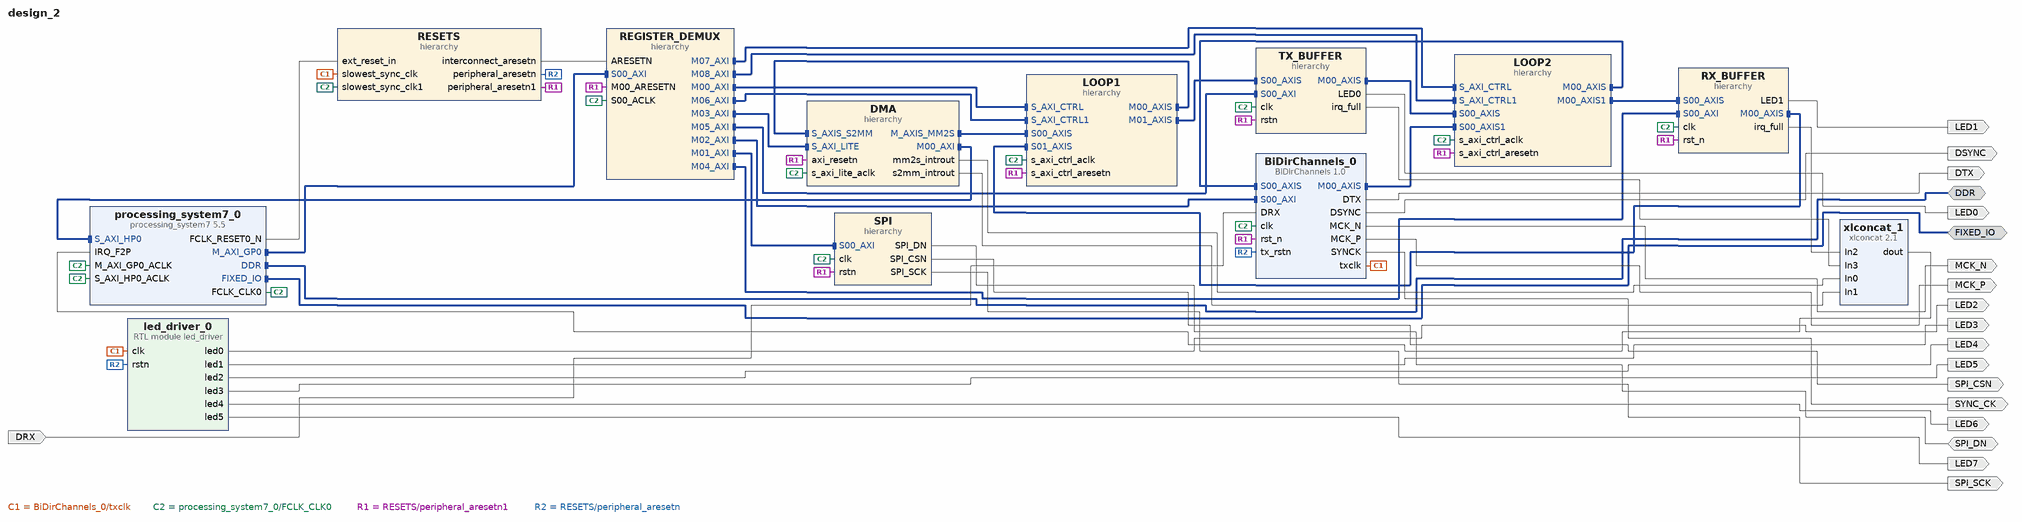
[diagram p0: block diagram of the top level]
# Vivado block design design_2, xc7z020clg484-1, Vivado 2021.2
create_bd_design design_2

create_bd_intf_port -mode Master -vlnv xilinx.com:interface:ddrx_rtl:1.0 DDR
create_bd_intf_port -mode Master -vlnv xilinx.com:display_processing_system7:fixedio_rtl:1.0 FIXED_IO
create_bd_port -dir O -type data SPI_SCK
create_bd_port -dir O -type data SPI_CSN
create_bd_port -dir I -type data DRX
create_bd_port -dir O -type data DSYNC
create_bd_port -dir O -type data DTX
create_bd_port -dir O -type clk SYNC_CK
create_bd_port -dir O -type clk MCK_N
create_bd_port -dir O -type clk MCK_P
create_bd_port -dir O LED0
create_bd_port -dir O LED1
create_bd_port -dir O LED2
create_bd_port -dir O LED3
create_bd_port -dir O LED4
create_bd_port -dir O LED5
create_bd_port -dir O LED6
create_bd_port -dir O LED7
create_bd_port -dir IO SPI_DN

create_bd_cell -type ip -vlnv xilinx.com:ip:processing_system7:5.5 processing_system7_0
set_property -dict [list \
  CONFIG.PCW_APU_PERIPHERAL_FREQMHZ 666.666667 \
  CONFIG.PCW_ENET0_ENET0_IO {MIO 16 .. 27} \
  CONFIG.PCW_ENET0_GRP_MDIO_ENABLE 1 \
  CONFIG.PCW_ENET0_GRP_MDIO_IO {MIO 52 .. 53} \
  CONFIG.PCW_ENET0_PERIPHERAL_ENABLE 1 \
  CONFIG.PCW_ENET0_RESET_ENABLE 0 \
  CONFIG.PCW_ENET_RESET_ENABLE 1 \
  CONFIG.PCW_ENET_RESET_SELECT {Share reset pin} \
  CONFIG.PCW_FPGA0_PERIPHERAL_FREQMHZ 100.000000 \
  CONFIG.PCW_FPGA1_PERIPHERAL_FREQMHZ 150.000000 \
  CONFIG.PCW_GPIO_MIO_GPIO_ENABLE 1 \
  CONFIG.PCW_GPIO_MIO_GPIO_IO MIO \
  CONFIG.PCW_I2C_RESET_ENABLE 1 \
  CONFIG.PCW_IRQ_F2P_INTR 1 \
  CONFIG.PCW_PERIPHERAL_BOARD_PRESET part0 \
  CONFIG.PCW_PRESET_BANK1_VOLTAGE {LVCMOS 1.8V} \
  CONFIG.PCW_QSPI_GRP_SINGLE_SS_ENABLE 1 \
  CONFIG.PCW_QSPI_GRP_SINGLE_SS_IO {MIO 1 .. 6} \
  CONFIG.PCW_QSPI_PERIPHERAL_ENABLE 1 \
  CONFIG.PCW_QSPI_QSPI_IO {MIO 1 .. 6} \
  CONFIG.PCW_SD0_GRP_CD_ENABLE 1 \
  CONFIG.PCW_SD0_GRP_CD_IO {MIO 47} \
  CONFIG.PCW_SD0_GRP_WP_ENABLE 1 \
  CONFIG.PCW_SD0_GRP_WP_IO {MIO 46} \
  CONFIG.PCW_SD0_PERIPHERAL_ENABLE 1 \
  CONFIG.PCW_SD0_SD0_IO {MIO 40 .. 45} \
  CONFIG.PCW_SDIO_PERIPHERAL_FREQMHZ 50 \
  CONFIG.PCW_SINGLE_QSPI_DATA_MODE x4 \
  CONFIG.PCW_TTC0_PERIPHERAL_ENABLE 1 \
  CONFIG.PCW_TTC0_TTC0_IO EMIO \
  CONFIG.PCW_UART1_PERIPHERAL_ENABLE 1 \
  CONFIG.PCW_UART1_UART1_IO {MIO 48 .. 49} \
  CONFIG.PCW_UART_PERIPHERAL_FREQMHZ 50 \
  CONFIG.PCW_UIPARAM_DDR_FREQ_MHZ 533.333313 \
  CONFIG.PCW_UIPARAM_DDR_PARTNO {MT41J128M16 HA-15E} \
  CONFIG.PCW_USB0_PERIPHERAL_ENABLE 1 \
  CONFIG.PCW_USB0_RESET_ENABLE 0 \
  CONFIG.PCW_USB0_USB0_IO {MIO 28 .. 39} \
  CONFIG.PCW_USB_RESET_ENABLE 1 \
  CONFIG.PCW_USB_RESET_SELECT {Share reset pin} \
  CONFIG.PCW_USE_FABRIC_INTERRUPT 1 \
  CONFIG.PCW_USE_S_AXI_HP0 1 \
  CONFIG.preset ZedBoard \
] [get_bd_cells processing_system7_0]
# 516 more settings of processing_system7_0 are not shown: defaults, MIO pin electricals, DDR timing, and values the tool derives
create_bd_cell -type hier RX_BUFFER
create_bd_cell -type hier LOOP1
create_bd_cell -type hier LOOP2
create_bd_cell -type hier RESETS
create_bd_cell -type hier SPI
create_bd_cell -type hier DMA
create_bd_cell -type hier REGISTER_DEMUX
create_bd_cell -type hier TX_BUFFER
create_bd_cell -type module -reference led_driver led_driver_0
create_bd_cell -type ip -vlnv xilinx.com:user:BiDirChannels:1.0 BiDirChannels_0
create_bd_cell -type ip -vlnv xilinx.com:ip:xlconcat:2.1 xlconcat_1
set_property -dict {CONFIG.NUM_PORTS 4} [get_bd_cells xlconcat_1]

# ---- hierarchy /RX_BUFFER ----
current_bd_instance /RX_BUFFER
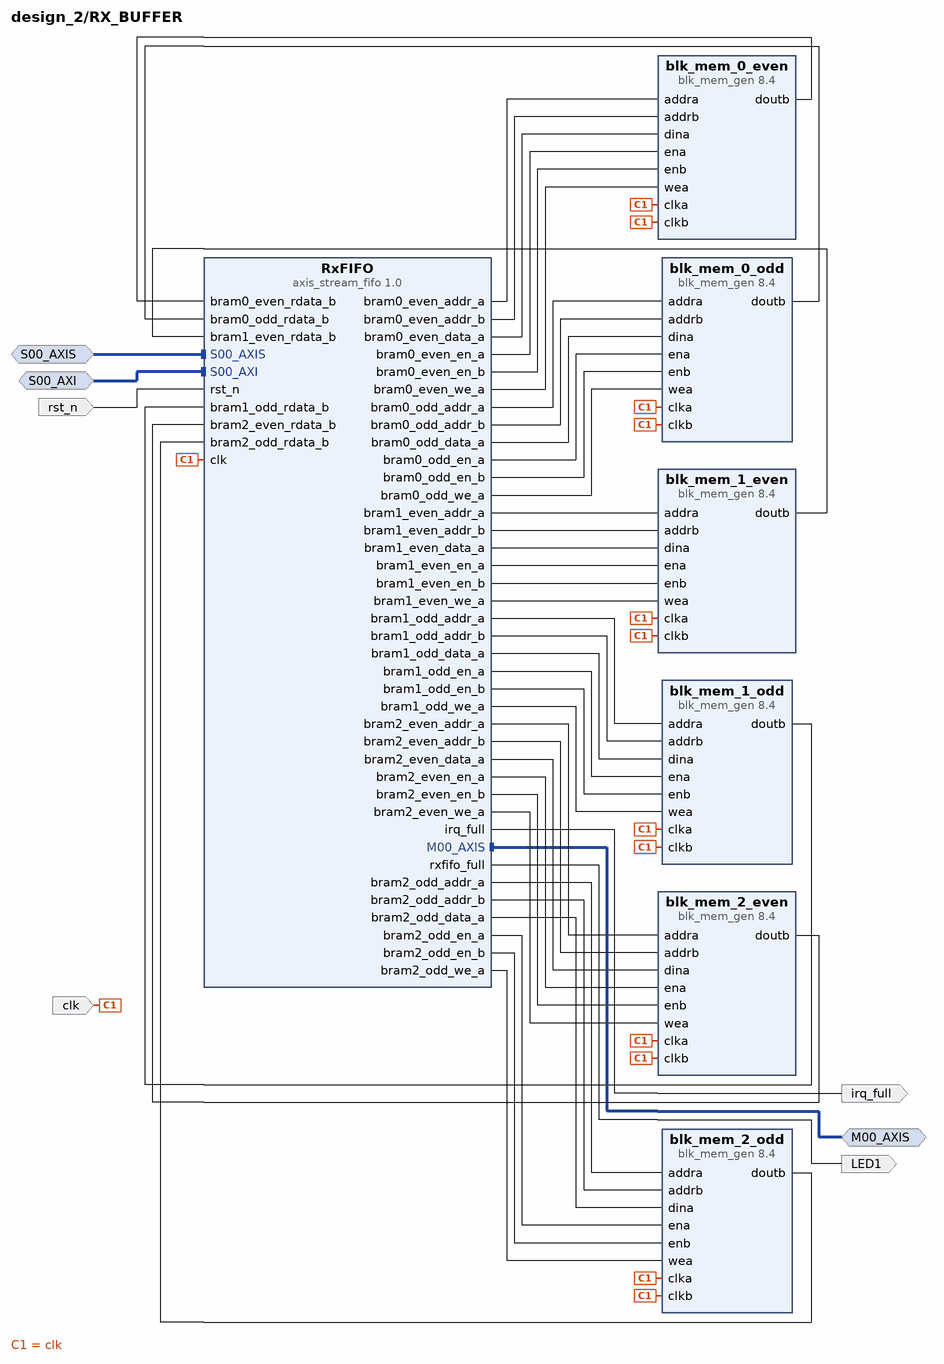
[diagram p1: block diagram inside /RX_BUFFER]
create_bd_intf_pin -mode Slave -vlnv xilinx.com:interface:aximm_rtl:1.0 S00_AXI
create_bd_intf_pin -mode Slave -vlnv xilinx.com:interface:axis_rtl:1.0 S00_AXIS
create_bd_intf_pin -mode Master -vlnv xilinx.com:interface:axis_rtl:1.0 M00_AXIS
create_bd_pin -dir I -type clk clk
create_bd_pin -dir I -type rst rst_n
create_bd_pin -dir O LED1
create_bd_pin -dir O irq_full

create_bd_cell -type ip -vlnv xilinx.com:ip:blk_mem_gen:8.4 blk_mem_1_even
set_property -dict [list \
  CONFIG.Assume_Synchronous_Clk true \
  CONFIG.Enable_32bit_Address false \
  CONFIG.Enable_B Use_ENB_Pin \
  CONFIG.Memory_Type Simple_Dual_Port_RAM \
  CONFIG.Operating_Mode_A NO_CHANGE \
  CONFIG.Port_A_Write_Rate 50 \
  CONFIG.Port_B_Clock 100 \
  CONFIG.Port_B_Enable_Rate 100 \
  CONFIG.Read_Width_B 16 \
  CONFIG.Register_PortB_Output_of_Memory_Primitives true \
  CONFIG.Use_Byte_Write_Enable false \
  CONFIG.Use_RSTB_Pin false \
  CONFIG.Write_Width_A 16 \
  CONFIG.Write_Width_B 16 \
  CONFIG.use_bram_block Stand_Alone \
] [get_bd_cells blk_mem_1_even]
create_bd_cell -type ip -vlnv xilinx.com:ip:blk_mem_gen:8.4 blk_mem_2_odd
set_property -dict [list \
  CONFIG.Assume_Synchronous_Clk true \
  CONFIG.Enable_32bit_Address false \
  CONFIG.Enable_B Use_ENB_Pin \
  CONFIG.Memory_Type Simple_Dual_Port_RAM \
  CONFIG.Operating_Mode_A NO_CHANGE \
  CONFIG.Port_A_Write_Rate 50 \
  CONFIG.Port_B_Clock 100 \
  CONFIG.Port_B_Enable_Rate 100 \
  CONFIG.Read_Width_B 16 \
  CONFIG.Register_PortB_Output_of_Memory_Primitives true \
  CONFIG.Use_Byte_Write_Enable false \
  CONFIG.Use_RSTB_Pin false \
  CONFIG.Write_Width_A 16 \
  CONFIG.Write_Width_B 16 \
  CONFIG.use_bram_block Stand_Alone \
] [get_bd_cells blk_mem_2_odd]
create_bd_cell -type ip -vlnv xilinx.com:ip:blk_mem_gen:8.4 blk_mem_2_even
set_property -dict [list \
  CONFIG.Assume_Synchronous_Clk true \
  CONFIG.Enable_32bit_Address false \
  CONFIG.Enable_B Use_ENB_Pin \
  CONFIG.Memory_Type Simple_Dual_Port_RAM \
  CONFIG.Operating_Mode_A NO_CHANGE \
  CONFIG.Port_A_Write_Rate 50 \
  CONFIG.Port_B_Clock 100 \
  CONFIG.Port_B_Enable_Rate 100 \
  CONFIG.Read_Width_B 16 \
  CONFIG.Register_PortB_Output_of_Memory_Primitives true \
  CONFIG.Use_Byte_Write_Enable false \
  CONFIG.Use_RSTB_Pin false \
  CONFIG.Write_Width_A 16 \
  CONFIG.Write_Width_B 16 \
  CONFIG.use_bram_block Stand_Alone \
] [get_bd_cells blk_mem_2_even]
create_bd_cell -type ip -vlnv xilinx.com:ip:blk_mem_gen:8.4 blk_mem_0_even
set_property -dict [list \
  CONFIG.Assume_Synchronous_Clk true \
  CONFIG.Enable_32bit_Address false \
  CONFIG.Enable_B Use_ENB_Pin \
  CONFIG.Memory_Type Simple_Dual_Port_RAM \
  CONFIG.Operating_Mode_A NO_CHANGE \
  CONFIG.Port_A_Write_Rate 50 \
  CONFIG.Port_B_Clock 100 \
  CONFIG.Port_B_Enable_Rate 100 \
  CONFIG.Read_Width_B 16 \
  CONFIG.Register_PortB_Output_of_Memory_Primitives true \
  CONFIG.Use_Byte_Write_Enable false \
  CONFIG.Use_RSTB_Pin false \
  CONFIG.Write_Width_A 16 \
  CONFIG.Write_Width_B 16 \
  CONFIG.use_bram_block Stand_Alone \
] [get_bd_cells blk_mem_0_even]
create_bd_cell -type ip -vlnv xilinx.com:ip:blk_mem_gen:8.4 blk_mem_1_odd
set_property -dict [list \
  CONFIG.Assume_Synchronous_Clk true \
  CONFIG.Enable_32bit_Address false \
  CONFIG.Enable_B Use_ENB_Pin \
  CONFIG.Memory_Type Simple_Dual_Port_RAM \
  CONFIG.Operating_Mode_A NO_CHANGE \
  CONFIG.Port_A_Write_Rate 50 \
  CONFIG.Port_B_Clock 100 \
  CONFIG.Port_B_Enable_Rate 100 \
  CONFIG.Read_Width_B 16 \
  CONFIG.Register_PortB_Output_of_Memory_Primitives true \
  CONFIG.Use_Byte_Write_Enable false \
  CONFIG.Use_RSTB_Pin false \
  CONFIG.Write_Width_A 16 \
  CONFIG.Write_Width_B 16 \
  CONFIG.use_bram_block Stand_Alone \
] [get_bd_cells blk_mem_1_odd]
create_bd_cell -type ip -vlnv xilinx.com:ip:blk_mem_gen:8.4 blk_mem_0_odd
set_property -dict [list \
  CONFIG.Assume_Synchronous_Clk true \
  CONFIG.Enable_32bit_Address false \
  CONFIG.Enable_B Use_ENB_Pin \
  CONFIG.Memory_Type Simple_Dual_Port_RAM \
  CONFIG.Operating_Mode_A NO_CHANGE \
  CONFIG.Port_A_Write_Rate 50 \
  CONFIG.Port_B_Clock 100 \
  CONFIG.Port_B_Enable_Rate 100 \
  CONFIG.Read_Width_B 16 \
  CONFIG.Register_PortB_Output_of_Memory_Primitives true \
  CONFIG.Use_Byte_Write_Enable false \
  CONFIG.Use_RSTB_Pin false \
  CONFIG.Write_Width_A 16 \
  CONFIG.Write_Width_B 16 \
  CONFIG.use_bram_block Stand_Alone \
] [get_bd_cells blk_mem_0_odd]
create_bd_cell -type ip -vlnv xilinx.com:user:axis_stream_fifo:1.0 RxFIFO
set_property -dict {CONFIG.C_S00_AXIS_TDATA_WIDTH 48} [get_bd_cells RxFIFO]

# ---- hierarchy /LOOP1 ----
current_bd_instance /LOOP1
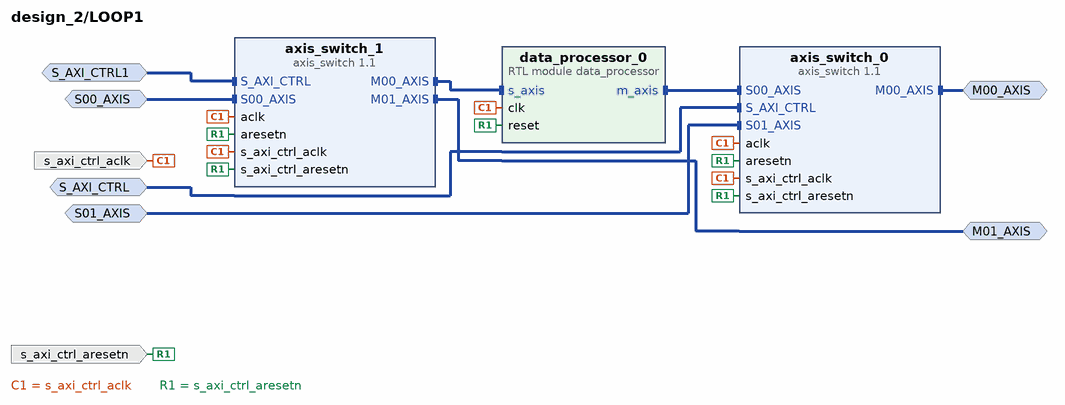
[diagram p2: block diagram inside /LOOP1]
create_bd_intf_pin -mode Master -vlnv xilinx.com:interface:axis_rtl:1.0 M00_AXIS
create_bd_intf_pin -mode Slave -vlnv xilinx.com:interface:axis_rtl:1.0 S01_AXIS
create_bd_intf_pin -mode Slave -vlnv xilinx.com:interface:aximm_rtl:1.0 S_AXI_CTRL
create_bd_intf_pin -mode Slave -vlnv xilinx.com:interface:axis_rtl:1.0 S00_AXIS
create_bd_intf_pin -mode Master -vlnv xilinx.com:interface:axis_rtl:1.0 M01_AXIS
create_bd_intf_pin -mode Slave -vlnv xilinx.com:interface:aximm_rtl:1.0 S_AXI_CTRL1
create_bd_pin -dir I -type clk s_axi_ctrl_aclk
create_bd_pin -dir I -type rst s_axi_ctrl_aresetn

create_bd_cell -type ip -vlnv xilinx.com:ip:axis_switch:1.1 axis_switch_0
set_property -dict {CONFIG.ROUTING_MODE 1} [get_bd_cells axis_switch_0]
create_bd_cell -type ip -vlnv xilinx.com:ip:axis_switch:1.1 axis_switch_1
set_property -dict {CONFIG.DECODER_REG 1 CONFIG.NUM_MI 2 CONFIG.NUM_SI 1 CONFIG.ROUTING_MODE 1} [get_bd_cells axis_switch_1]
create_bd_cell -type module -reference data_processor data_processor_0

# ---- hierarchy /LOOP2 ----
current_bd_instance /LOOP2
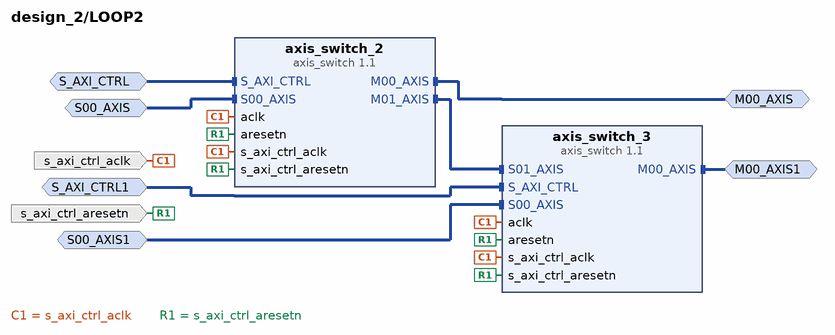
[diagram p3: block diagram inside /LOOP2]
create_bd_intf_pin -mode Slave -vlnv xilinx.com:interface:axis_rtl:1.0 S00_AXIS
create_bd_intf_pin -mode Master -vlnv xilinx.com:interface:axis_rtl:1.0 M00_AXIS
create_bd_intf_pin -mode Slave -vlnv xilinx.com:interface:aximm_rtl:1.0 S_AXI_CTRL
create_bd_intf_pin -mode Slave -vlnv xilinx.com:interface:axis_rtl:1.0 S00_AXIS1
create_bd_intf_pin -mode Master -vlnv xilinx.com:interface:axis_rtl:1.0 M00_AXIS1
create_bd_intf_pin -mode Slave -vlnv xilinx.com:interface:aximm_rtl:1.0 S_AXI_CTRL1
create_bd_pin -dir I -type clk s_axi_ctrl_aclk
create_bd_pin -dir I -type rst s_axi_ctrl_aresetn

create_bd_cell -type ip -vlnv xilinx.com:ip:axis_switch:1.1 axis_switch_2
set_property -dict {CONFIG.DECODER_REG 1 CONFIG.NUM_MI 2 CONFIG.NUM_SI 1 CONFIG.ROUTING_MODE 1} [get_bd_cells axis_switch_2]
create_bd_cell -type ip -vlnv xilinx.com:ip:axis_switch:1.1 axis_switch_3
set_property -dict {CONFIG.ROUTING_MODE 1} [get_bd_cells axis_switch_3]

# ---- hierarchy /RESETS ----
current_bd_instance /RESETS
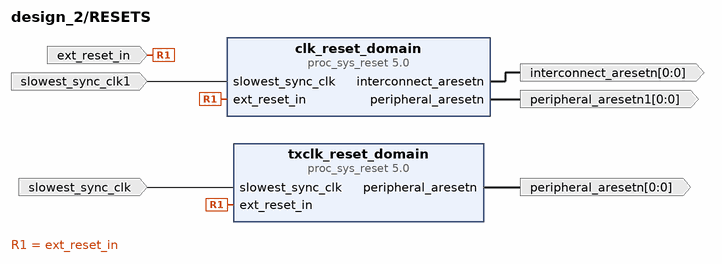
[diagram p4: block diagram inside /RESETS]
create_bd_pin -dir I -type clk slowest_sync_clk
create_bd_pin -dir I -type rst ext_reset_in
create_bd_pin -dir O -from 0 -to 0 -type rst peripheral_aresetn
create_bd_pin -dir I -type clk slowest_sync_clk1
create_bd_pin -dir O -from 0 -to 0 -type rst interconnect_aresetn
create_bd_pin -dir O -from 0 -to 0 -type rst peripheral_aresetn1

create_bd_cell -type ip -vlnv xilinx.com:ip:proc_sys_reset:5.0 txclk_reset_domain
create_bd_cell -type ip -vlnv xilinx.com:ip:proc_sys_reset:5.0 clk_reset_domain

# ---- hierarchy /SPI ----
current_bd_instance /SPI
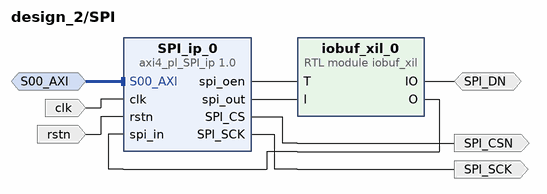
[diagram p5: block diagram inside /SPI]
create_bd_intf_pin -mode Slave -vlnv xilinx.com:interface:aximm_rtl:1.0 S00_AXI
create_bd_pin -dir I -type clk clk
create_bd_pin -dir I -type rst rstn
create_bd_pin -dir O SPI_SCK
create_bd_pin -dir O SPI_CSN
create_bd_pin -dir IO SPI_DN

create_bd_cell -type ip -vlnv xilinx.com:user:axi4_pl_SPI_ip:1.0 SPI_ip_0
create_bd_cell -type module -reference iobuf_xil iobuf_xil_0

# ---- hierarchy /DMA ----
current_bd_instance /DMA
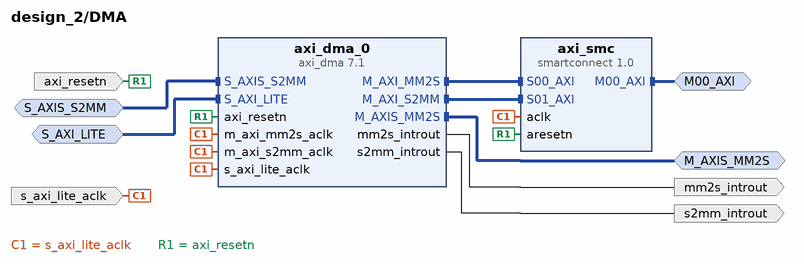
[diagram p6: block diagram inside /DMA]
create_bd_intf_pin -mode Master -vlnv xilinx.com:interface:aximm_rtl:1.0 M00_AXI
create_bd_intf_pin -mode Slave -vlnv xilinx.com:interface:aximm_rtl:1.0 S_AXI_LITE
create_bd_intf_pin -mode Master -vlnv xilinx.com:interface:axis_rtl:1.0 M_AXIS_MM2S
create_bd_intf_pin -mode Slave -vlnv xilinx.com:interface:axis_rtl:1.0 S_AXIS_S2MM
create_bd_pin -dir I -type clk s_axi_lite_aclk
create_bd_pin -dir I -type rst axi_resetn
create_bd_pin -dir O -type intr mm2s_introut
create_bd_pin -dir O -type intr s2mm_introut

create_bd_cell -type ip -vlnv xilinx.com:ip:smartconnect:1.0 axi_smc
set_property -dict {CONFIG.NUM_SI 2} [get_bd_cells axi_smc]
create_bd_cell -type ip -vlnv xilinx.com:ip:axi_dma:7.1 axi_dma_0
set_property -dict [list \
  CONFIG.c_include_sg 0 \
  CONFIG.c_mm2s_burst_size 256 \
  CONFIG.c_s2mm_burst_size 256 \
  CONFIG.c_sg_length_width 26 \
] [get_bd_cells axi_dma_0]

# ---- hierarchy /REGISTER_DEMUX ----
current_bd_instance /REGISTER_DEMUX
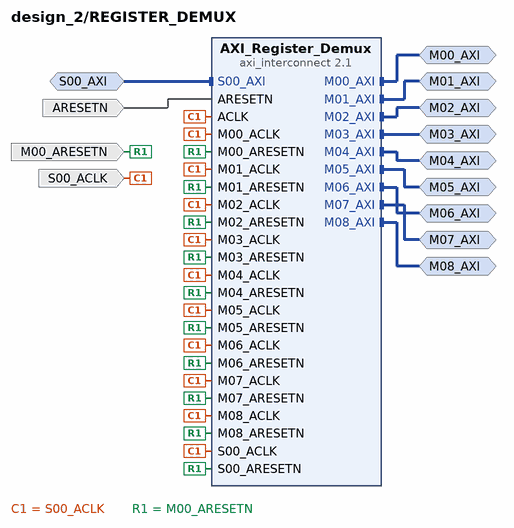
[diagram p7: block diagram inside /REGISTER_DEMUX]
create_bd_intf_pin -mode Slave -vlnv xilinx.com:interface:aximm_rtl:1.0 S00_AXI
create_bd_intf_pin -mode Master -vlnv xilinx.com:interface:aximm_rtl:1.0 M00_AXI
create_bd_intf_pin -mode Master -vlnv xilinx.com:interface:aximm_rtl:1.0 M01_AXI
create_bd_intf_pin -mode Master -vlnv xilinx.com:interface:aximm_rtl:1.0 M02_AXI
create_bd_intf_pin -mode Master -vlnv xilinx.com:interface:aximm_rtl:1.0 M03_AXI
create_bd_intf_pin -mode Master -vlnv xilinx.com:interface:aximm_rtl:1.0 M04_AXI
create_bd_intf_pin -mode Master -vlnv xilinx.com:interface:aximm_rtl:1.0 M05_AXI
create_bd_intf_pin -mode Master -vlnv xilinx.com:interface:aximm_rtl:1.0 M06_AXI
create_bd_intf_pin -mode Master -vlnv xilinx.com:interface:aximm_rtl:1.0 M07_AXI
create_bd_intf_pin -mode Master -vlnv xilinx.com:interface:aximm_rtl:1.0 M08_AXI
create_bd_pin -dir I -type clk S00_ACLK
create_bd_pin -dir I -type rst ARESETN
create_bd_pin -dir I -type rst M00_ARESETN

create_bd_cell -type ip -vlnv xilinx.com:ip:axi_interconnect:2.1 AXI_Register_Demux
set_property -dict {CONFIG.NUM_MI 9} [get_bd_cells AXI_Register_Demux]

# ---- hierarchy /TX_BUFFER ----
current_bd_instance /TX_BUFFER
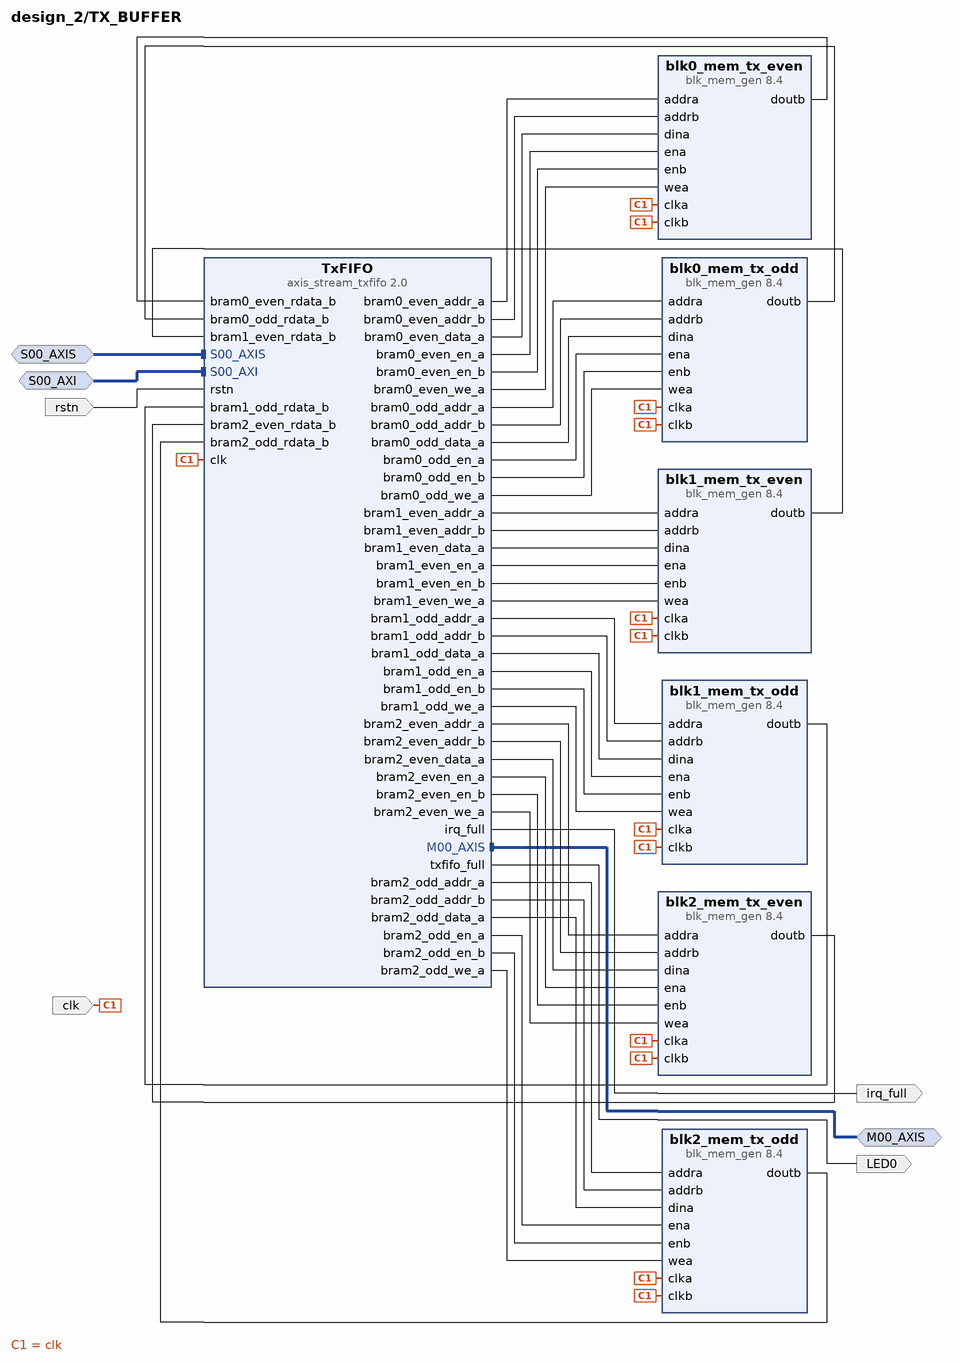
[diagram p8: block diagram inside /TX_BUFFER]
create_bd_intf_pin -mode Slave -vlnv xilinx.com:interface:aximm_rtl:1.0 S00_AXI
create_bd_intf_pin -mode Slave -vlnv xilinx.com:interface:axis_rtl:1.0 S00_AXIS
create_bd_intf_pin -mode Master -vlnv xilinx.com:interface:axis_rtl:1.0 M00_AXIS
create_bd_pin -dir I -type clk clk
create_bd_pin -dir I -type rst rstn
create_bd_pin -dir O LED0
create_bd_pin -dir O irq_full

create_bd_cell -type ip -vlnv xilinx.com:ip:blk_mem_gen:8.4 blk1_mem_tx_odd
set_property -dict [list \
  CONFIG.Assume_Synchronous_Clk true \
  CONFIG.Enable_32bit_Address false \
  CONFIG.Enable_B Use_ENB_Pin \
  CONFIG.Memory_Type Simple_Dual_Port_RAM \
  CONFIG.Operating_Mode_A NO_CHANGE \
  CONFIG.Port_A_Write_Rate 50 \
  CONFIG.Port_B_Clock 100 \
  CONFIG.Port_B_Enable_Rate 100 \
  CONFIG.Read_Width_B 16 \
  CONFIG.Register_PortB_Output_of_Memory_Primitives true \
  CONFIG.Use_Byte_Write_Enable false \
  CONFIG.Use_RSTB_Pin false \
  CONFIG.Write_Depth_A 8192 \
  CONFIG.Write_Width_A 16 \
  CONFIG.Write_Width_B 16 \
  CONFIG.use_bram_block Stand_Alone \
] [get_bd_cells blk1_mem_tx_odd]
create_bd_cell -type ip -vlnv xilinx.com:ip:blk_mem_gen:8.4 blk1_mem_tx_even
set_property -dict [list \
  CONFIG.Assume_Synchronous_Clk true \
  CONFIG.Enable_32bit_Address false \
  CONFIG.Enable_B Use_ENB_Pin \
  CONFIG.Memory_Type Simple_Dual_Port_RAM \
  CONFIG.Operating_Mode_A NO_CHANGE \
  CONFIG.Port_A_Write_Rate 50 \
  CONFIG.Port_B_Clock 100 \
  CONFIG.Port_B_Enable_Rate 100 \
  CONFIG.Read_Width_B 16 \
  CONFIG.Register_PortB_Output_of_Memory_Primitives true \
  CONFIG.Use_Byte_Write_Enable false \
  CONFIG.Use_RSTB_Pin false \
  CONFIG.Write_Depth_A 8192 \
  CONFIG.Write_Width_A 16 \
  CONFIG.Write_Width_B 16 \
  CONFIG.use_bram_block Stand_Alone \
] [get_bd_cells blk1_mem_tx_even]
create_bd_cell -type ip -vlnv xilinx.com:ip:blk_mem_gen:8.4 blk0_mem_tx_even
set_property -dict [list \
  CONFIG.Assume_Synchronous_Clk true \
  CONFIG.Enable_32bit_Address false \
  CONFIG.Enable_B Use_ENB_Pin \
  CONFIG.Memory_Type Simple_Dual_Port_RAM \
  CONFIG.Operating_Mode_A NO_CHANGE \
  CONFIG.Port_A_Write_Rate 50 \
  CONFIG.Port_B_Clock 100 \
  CONFIG.Port_B_Enable_Rate 100 \
  CONFIG.Read_Width_B 16 \
  CONFIG.Register_PortB_Output_of_Memory_Primitives true \
  CONFIG.Use_Byte_Write_Enable false \
  CONFIG.Use_RSTB_Pin false \
  CONFIG.Write_Depth_A 8192 \
  CONFIG.Write_Width_A 16 \
  CONFIG.Write_Width_B 16 \
  CONFIG.use_bram_block Stand_Alone \
] [get_bd_cells blk0_mem_tx_even]
create_bd_cell -type ip -vlnv xilinx.com:ip:blk_mem_gen:8.4 blk2_mem_tx_even
set_property -dict [list \
  CONFIG.Assume_Synchronous_Clk true \
  CONFIG.Enable_32bit_Address false \
  CONFIG.Enable_B Use_ENB_Pin \
  CONFIG.Memory_Type Simple_Dual_Port_RAM \
  CONFIG.Operating_Mode_A NO_CHANGE \
  CONFIG.Port_A_Write_Rate 50 \
  CONFIG.Port_B_Clock 100 \
  CONFIG.Port_B_Enable_Rate 100 \
  CONFIG.Read_Width_B 16 \
  CONFIG.Register_PortB_Output_of_Memory_Primitives true \
  CONFIG.Use_Byte_Write_Enable false \
  CONFIG.Use_RSTB_Pin false \
  CONFIG.Write_Depth_A 8192 \
  CONFIG.Write_Width_A 16 \
  CONFIG.Write_Width_B 16 \
  CONFIG.use_bram_block Stand_Alone \
] [get_bd_cells blk2_mem_tx_even]
create_bd_cell -type ip -vlnv xilinx.com:ip:blk_mem_gen:8.4 blk2_mem_tx_odd
set_property -dict [list \
  CONFIG.Assume_Synchronous_Clk true \
  CONFIG.Enable_32bit_Address false \
  CONFIG.Enable_B Use_ENB_Pin \
  CONFIG.Memory_Type Simple_Dual_Port_RAM \
  CONFIG.Operating_Mode_A NO_CHANGE \
  CONFIG.Port_A_Write_Rate 50 \
  CONFIG.Port_B_Clock 100 \
  CONFIG.Port_B_Enable_Rate 100 \
  CONFIG.Read_Width_B 16 \
  CONFIG.Register_PortB_Output_of_Memory_Primitives true \
  CONFIG.Use_Byte_Write_Enable false \
  CONFIG.Use_RSTB_Pin false \
  CONFIG.Write_Depth_A 8192 \
  CONFIG.Write_Width_A 16 \
  CONFIG.Write_Width_B 16 \
  CONFIG.use_bram_block Stand_Alone \
] [get_bd_cells blk2_mem_tx_odd]
create_bd_cell -type ip -vlnv xilinx.com:ip:blk_mem_gen:8.4 blk0_mem_tx_odd
set_property -dict [list \
  CONFIG.Assume_Synchronous_Clk true \
  CONFIG.Enable_32bit_Address false \
  CONFIG.Enable_B Use_ENB_Pin \
  CONFIG.Memory_Type Simple_Dual_Port_RAM \
  CONFIG.Operating_Mode_A NO_CHANGE \
  CONFIG.Port_A_Write_Rate 50 \
  CONFIG.Port_B_Clock 100 \
  CONFIG.Port_B_Enable_Rate 100 \
  CONFIG.Read_Width_B 16 \
  CONFIG.Register_PortB_Output_of_Memory_Primitives true \
  CONFIG.Use_Byte_Write_Enable false \
  CONFIG.Use_RSTB_Pin false \
  CONFIG.Write_Depth_A 8192 \
  CONFIG.Write_Width_A 16 \
  CONFIG.Write_Width_B 16 \
  CONFIG.use_bram_block Stand_Alone \
] [get_bd_cells blk0_mem_tx_odd]
create_bd_cell -type ip -vlnv user.org:user:axis_stream_txfifo:2.0 TxFIFO
set_property -dict {CONFIG.ADDR_WIDTH 11} [get_bd_cells TxFIFO]

# ---- connections ----

current_bd_instance /RX_BUFFER
connect_bd_intf_net [get_bd_intf_pins M00_AXIS] [get_bd_intf_pins RxFIFO/M00_AXIS]
connect_bd_intf_net -intf_net axis_switch_3_M00_AXIS [get_bd_intf_pins S00_AXIS] [get_bd_intf_pins RxFIFO/S00_AXIS]
connect_bd_intf_net [get_bd_intf_pins S00_AXI] [get_bd_intf_pins RxFIFO/S00_AXI]
connect_bd_net [get_bd_pins RxFIFO/bram0_even_addr_a] [get_bd_pins blk_mem_0_even/addra]
connect_bd_net [get_bd_pins RxFIFO/bram0_even_addr_b] [get_bd_pins blk_mem_0_even/addrb]
connect_bd_net [get_bd_pins RxFIFO/bram0_even_data_a] [get_bd_pins blk_mem_0_even/dina]
connect_bd_net [get_bd_pins RxFIFO/bram0_even_en_a] [get_bd_pins blk_mem_0_even/ena]
connect_bd_net [get_bd_pins RxFIFO/bram0_even_en_b] [get_bd_pins blk_mem_0_even/enb]
connect_bd_net [get_bd_pins RxFIFO/bram0_even_we_a] [get_bd_pins blk_mem_0_even/wea]
connect_bd_net [get_bd_pins RxFIFO/bram0_odd_addr_a] [get_bd_pins blk_mem_0_odd/addra]
connect_bd_net [get_bd_pins RxFIFO/bram0_odd_addr_b] [get_bd_pins blk_mem_0_odd/addrb]
connect_bd_net [get_bd_pins RxFIFO/bram0_odd_data_a] [get_bd_pins blk_mem_0_odd/dina]
connect_bd_net [get_bd_pins RxFIFO/bram0_odd_en_a] [get_bd_pins blk_mem_0_odd/ena]
connect_bd_net [get_bd_pins RxFIFO/bram0_odd_en_b] [get_bd_pins blk_mem_0_odd/enb]
connect_bd_net [get_bd_pins RxFIFO/bram0_odd_we_a] [get_bd_pins blk_mem_0_odd/wea]
connect_bd_net [get_bd_pins RxFIFO/bram1_even_addr_a] [get_bd_pins blk_mem_1_even/addra]
connect_bd_net [get_bd_pins RxFIFO/bram1_even_addr_b] [get_bd_pins blk_mem_1_even/addrb]
connect_bd_net [get_bd_pins RxFIFO/bram1_even_data_a] [get_bd_pins blk_mem_1_even/dina]
connect_bd_net [get_bd_pins RxFIFO/bram1_even_en_a] [get_bd_pins blk_mem_1_even/ena]
connect_bd_net [get_bd_pins RxFIFO/bram1_even_en_b] [get_bd_pins blk_mem_1_even/enb]
connect_bd_net [get_bd_pins RxFIFO/bram1_even_we_a] [get_bd_pins blk_mem_1_even/wea]
connect_bd_net [get_bd_pins RxFIFO/bram1_odd_addr_a] [get_bd_pins blk_mem_1_odd/addra]
connect_bd_net [get_bd_pins RxFIFO/bram1_odd_addr_b] [get_bd_pins blk_mem_1_odd/addrb]
connect_bd_net [get_bd_pins RxFIFO/bram1_odd_data_a] [get_bd_pins blk_mem_1_odd/dina]
connect_bd_net [get_bd_pins RxFIFO/bram1_odd_en_a] [get_bd_pins blk_mem_1_odd/ena]
connect_bd_net [get_bd_pins RxFIFO/bram1_odd_en_b] [get_bd_pins blk_mem_1_odd/enb]
connect_bd_net [get_bd_pins RxFIFO/bram1_odd_we_a] [get_bd_pins blk_mem_1_odd/wea]
connect_bd_net [get_bd_pins RxFIFO/bram2_even_addr_a] [get_bd_pins blk_mem_2_even/addra]
connect_bd_net [get_bd_pins RxFIFO/bram2_even_addr_b] [get_bd_pins blk_mem_2_even/addrb]
connect_bd_net [get_bd_pins RxFIFO/bram2_even_data_a] [get_bd_pins blk_mem_2_even/dina]
connect_bd_net [get_bd_pins RxFIFO/bram2_even_en_a] [get_bd_pins blk_mem_2_even/ena]
connect_bd_net [get_bd_pins RxFIFO/bram2_even_en_b] [get_bd_pins blk_mem_2_even/enb]
connect_bd_net [get_bd_pins RxFIFO/bram2_even_we_a] [get_bd_pins blk_mem_2_even/wea]
connect_bd_net [get_bd_pins RxFIFO/bram2_odd_addr_a] [get_bd_pins blk_mem_2_odd/addra]
connect_bd_net [get_bd_pins RxFIFO/bram2_odd_addr_b] [get_bd_pins blk_mem_2_odd/addrb]
connect_bd_net [get_bd_pins RxFIFO/bram2_odd_data_a] [get_bd_pins blk_mem_2_odd/dina]
connect_bd_net [get_bd_pins RxFIFO/bram2_odd_en_a] [get_bd_pins blk_mem_2_odd/ena]
connect_bd_net [get_bd_pins RxFIFO/bram2_odd_en_b] [get_bd_pins blk_mem_2_odd/enb]
connect_bd_net [get_bd_pins RxFIFO/bram2_odd_we_a] [get_bd_pins blk_mem_2_odd/wea]
connect_bd_net [get_bd_pins RxFIFO/irq_full] [get_bd_pins irq_full]
connect_bd_net [get_bd_pins RxFIFO/rxfifo_full] [get_bd_pins LED1]
connect_bd_net [get_bd_pins blk_mem_0_even/doutb] [get_bd_pins RxFIFO/bram0_even_rdata_b]
connect_bd_net [get_bd_pins blk_mem_0_odd/doutb] [get_bd_pins RxFIFO/bram0_odd_rdata_b]
connect_bd_net [get_bd_pins blk_mem_1_even/doutb] [get_bd_pins RxFIFO/bram1_even_rdata_b]
connect_bd_net [get_bd_pins blk_mem_1_odd/doutb] [get_bd_pins RxFIFO/bram1_odd_rdata_b]
connect_bd_net [get_bd_pins blk_mem_2_even/doutb] [get_bd_pins RxFIFO/bram2_even_rdata_b]
connect_bd_net [get_bd_pins blk_mem_2_odd/doutb] [get_bd_pins RxFIFO/bram2_odd_rdata_b]
connect_bd_net -net processing_system7_0_FCLK_CLK0 [get_bd_pins clk] \
  [get_bd_pins blk_mem_2_odd/clkb] [get_bd_pins blk_mem_2_odd/clka] [get_bd_pins blk_mem_2_even/clkb] \
  [get_bd_pins blk_mem_2_even/clka] [get_bd_pins blk_mem_1_odd/clkb] [get_bd_pins blk_mem_1_odd/clka] \
  [get_bd_pins blk_mem_1_even/clkb] [get_bd_pins blk_mem_0_odd/clkb] [get_bd_pins blk_mem_0_odd/clka] \
  [get_bd_pins blk_mem_0_even/clkb] [get_bd_pins blk_mem_0_even/clka] [get_bd_pins blk_mem_1_even/clka] \
  [get_bd_pins RxFIFO/clk]
connect_bd_net -net rst_ps7_0_100M_peripheral_aresetn [get_bd_pins rst_n] [get_bd_pins RxFIFO/rst_n]

current_bd_instance /LOOP1
connect_bd_intf_net -intf_net AXI_Register_Demux_M00_AXI [get_bd_intf_pins S_AXI_CTRL] [get_bd_intf_pins axis_switch_0/S_AXI_CTRL]
connect_bd_intf_net -intf_net AXI_Register_Demux_M06_AXI [get_bd_intf_pins S_AXI_CTRL1] [get_bd_intf_pins axis_switch_1/S_AXI_CTRL]
connect_bd_intf_net -intf_net RxFIFO_M00_AXIS [get_bd_intf_pins S01_AXIS] [get_bd_intf_pins axis_switch_0/S01_AXIS]
connect_bd_intf_net -intf_net axi_dma_0_M_AXIS_MM2S [get_bd_intf_pins S00_AXIS] [get_bd_intf_pins axis_switch_1/S00_AXIS]
connect_bd_intf_net [get_bd_intf_pins M00_AXIS] [get_bd_intf_pins axis_switch_0/M00_AXIS]
connect_bd_intf_net [get_bd_intf_pins axis_switch_1/M00_AXIS] [get_bd_intf_pins data_processor_0/s_axis]
connect_bd_intf_net [get_bd_intf_pins M01_AXIS] [get_bd_intf_pins axis_switch_1/M01_AXIS]
connect_bd_intf_net [get_bd_intf_pins axis_switch_0/S00_AXIS] [get_bd_intf_pins data_processor_0/m_axis]
connect_bd_net -net processing_system7_0_FCLK_CLK0 [get_bd_pins s_axi_ctrl_aclk] \
  [get_bd_pins axis_switch_1/s_axi_ctrl_aclk] [get_bd_pins axis_switch_1/aclk] [get_bd_pins axis_switch_0/s_axi_ctrl_aclk] \
  [get_bd_pins data_processor_0/clk] [get_bd_pins axis_switch_0/aclk]
connect_bd_net -net rst_ps7_0_100M_peripheral_aresetn [get_bd_pins s_axi_ctrl_aresetn] \
  [get_bd_pins axis_switch_1/s_axi_ctrl_aresetn] [get_bd_pins axis_switch_1/aresetn] \
  [get_bd_pins axis_switch_0/s_axi_ctrl_aresetn] [get_bd_pins data_processor_0/reset] [get_bd_pins axis_switch_0/aresetn]

current_bd_instance /LOOP2
connect_bd_intf_net -intf_net AXI_Register_Demux_M07_AXI [get_bd_intf_pins S_AXI_CTRL] [get_bd_intf_pins axis_switch_2/S_AXI_CTRL]
connect_bd_intf_net -intf_net AXI_Register_Demux_M08_AXI [get_bd_intf_pins S_AXI_CTRL1] [get_bd_intf_pins axis_switch_3/S_AXI_CTRL]
connect_bd_intf_net -intf_net BiDirChannels_0_M00_AXIS [get_bd_intf_pins S00_AXIS1] [get_bd_intf_pins axis_switch_3/S00_AXIS]
connect_bd_intf_net -intf_net TxFIFO_M00_AXIS [get_bd_intf_pins S00_AXIS] [get_bd_intf_pins axis_switch_2/S00_AXIS]
connect_bd_intf_net [get_bd_intf_pins M00_AXIS] [get_bd_intf_pins axis_switch_2/M00_AXIS]
connect_bd_intf_net [get_bd_intf_pins axis_switch_2/M01_AXIS] [get_bd_intf_pins axis_switch_3/S01_AXIS]
connect_bd_intf_net [get_bd_intf_pins M00_AXIS1] [get_bd_intf_pins axis_switch_3/M00_AXIS]
connect_bd_net -net processing_system7_0_FCLK_CLK0 [get_bd_pins s_axi_ctrl_aclk] \
  [get_bd_pins axis_switch_2/s_axi_ctrl_aclk] [get_bd_pins axis_switch_3/aclk] [get_bd_pins axis_switch_3/s_axi_ctrl_aclk] \
  [get_bd_pins axis_switch_2/aclk]
connect_bd_net -net rst_ps7_0_100M_peripheral_aresetn [get_bd_pins s_axi_ctrl_aresetn] \
  [get_bd_pins axis_switch_2/s_axi_ctrl_aresetn] [get_bd_pins axis_switch_3/aresetn] \
  [get_bd_pins axis_switch_3/s_axi_ctrl_aresetn] [get_bd_pins axis_switch_2/aresetn]

current_bd_instance /RESETS
connect_bd_net -net BiDirChannels_0_txclk [get_bd_pins slowest_sync_clk] [get_bd_pins txclk_reset_domain/slowest_sync_clk]
connect_bd_net -net proc_sys_reset_0_interconnect_aresetn [get_bd_pins clk_reset_domain/interconnect_aresetn] [get_bd_pins interconnect_aresetn]
connect_bd_net -net processing_system7_0_FCLK_CLK0 [get_bd_pins slowest_sync_clk1] [get_bd_pins clk_reset_domain/slowest_sync_clk]
connect_bd_net -net processing_system7_0_FCLK_RESET0_N [get_bd_pins ext_reset_in] \
  [get_bd_pins clk_reset_domain/ext_reset_in] [get_bd_pins txclk_reset_domain/ext_reset_in]
connect_bd_net -net rst_ps7_0_100M_peripheral_aresetn [get_bd_pins clk_reset_domain/peripheral_aresetn] [get_bd_pins peripheral_aresetn1]
connect_bd_net [get_bd_pins txclk_reset_domain/peripheral_aresetn] [get_bd_pins peripheral_aresetn]

current_bd_instance /SPI
connect_bd_intf_net [get_bd_intf_pins S00_AXI] [get_bd_intf_pins SPI_ip_0/S00_AXI]
connect_bd_net [get_bd_pins SPI_DN] [get_bd_pins iobuf_xil_0/IO]
connect_bd_net [get_bd_pins SPI_ip_0/SPI_CS] [get_bd_pins SPI_CSN]
connect_bd_net [get_bd_pins SPI_ip_0/SPI_SCK] [get_bd_pins SPI_SCK]
connect_bd_net [get_bd_pins SPI_ip_0/spi_oen] [get_bd_pins iobuf_xil_0/T]
connect_bd_net [get_bd_pins SPI_ip_0/spi_out] [get_bd_pins iobuf_xil_0/I]
connect_bd_net [get_bd_pins iobuf_xil_0/O] [get_bd_pins SPI_ip_0/spi_in]
connect_bd_net -net processing_system7_0_FCLK_CLK0 [get_bd_pins clk] [get_bd_pins SPI_ip_0/clk]
connect_bd_net -net rst_ps7_0_100M_peripheral_aresetn [get_bd_pins rstn] [get_bd_pins SPI_ip_0/rstn]

current_bd_instance /DMA
connect_bd_intf_net [get_bd_intf_pins M_AXIS_MM2S] [get_bd_intf_pins axi_dma_0/M_AXIS_MM2S]
connect_bd_intf_net [get_bd_intf_pins axi_dma_0/M_AXI_MM2S] [get_bd_intf_pins axi_smc/S00_AXI]
connect_bd_intf_net [get_bd_intf_pins axi_dma_0/M_AXI_S2MM] [get_bd_intf_pins axi_smc/S01_AXI]
connect_bd_intf_net -intf_net axis_switch_0_M00_AXIS [get_bd_intf_pins S_AXIS_S2MM] [get_bd_intf_pins axi_dma_0/S_AXIS_S2MM]
connect_bd_intf_net [get_bd_intf_pins S_AXI_LITE] [get_bd_intf_pins axi_dma_0/S_AXI_LITE]
connect_bd_intf_net -intf_net smartconnect_0_M00_AXI [get_bd_intf_pins M00_AXI] [get_bd_intf_pins axi_smc/M00_AXI]
connect_bd_net [get_bd_pins axi_dma_0/mm2s_introut] [get_bd_pins mm2s_introut]
connect_bd_net [get_bd_pins axi_dma_0/s2mm_introut] [get_bd_pins s2mm_introut]
connect_bd_net -net processing_system7_0_FCLK_CLK0 [get_bd_pins s_axi_lite_aclk] \
  [get_bd_pins axi_dma_0/s_axi_lite_aclk] [get_bd_pins axi_dma_0/m_axi_mm2s_aclk] [get_bd_pins axi_dma_0/m_axi_s2mm_aclk] \
  [get_bd_pins axi_smc/aclk]
connect_bd_net -net rst_ps7_0_100M_peripheral_aresetn [get_bd_pins axi_resetn] [get_bd_pins axi_dma_0/axi_resetn] [get_bd_pins axi_smc/aresetn]

current_bd_instance /REGISTER_DEMUX
connect_bd_intf_net [get_bd_intf_pins M00_AXI] [get_bd_intf_pins AXI_Register_Demux/M00_AXI]
connect_bd_intf_net [get_bd_intf_pins M06_AXI] [get_bd_intf_pins AXI_Register_Demux/M06_AXI]
connect_bd_intf_net [get_bd_intf_pins M07_AXI] [get_bd_intf_pins AXI_Register_Demux/M07_AXI]
connect_bd_intf_net [get_bd_intf_pins M08_AXI] [get_bd_intf_pins AXI_Register_Demux/M08_AXI]
connect_bd_intf_net -intf_net processing_system7_0_M_AXI_GP0 [get_bd_intf_pins S00_AXI] [get_bd_intf_pins AXI_Register_Demux/S00_AXI]
connect_bd_intf_net [get_bd_intf_pins M01_AXI] [get_bd_intf_pins AXI_Register_Demux/M01_AXI]
connect_bd_intf_net [get_bd_intf_pins M02_AXI] [get_bd_intf_pins AXI_Register_Demux/M02_AXI]
connect_bd_intf_net [get_bd_intf_pins M03_AXI] [get_bd_intf_pins AXI_Register_Demux/M03_AXI]
connect_bd_intf_net [get_bd_intf_pins M04_AXI] [get_bd_intf_pins AXI_Register_Demux/M04_AXI]
connect_bd_intf_net [get_bd_intf_pins M05_AXI] [get_bd_intf_pins AXI_Register_Demux/M05_AXI]
connect_bd_net -net proc_sys_reset_0_interconnect_aresetn [get_bd_pins ARESETN] [get_bd_pins AXI_Register_Demux/ARESETN]
connect_bd_net -net processing_system7_0_FCLK_CLK0 [get_bd_pins S00_ACLK] \
  [get_bd_pins AXI_Register_Demux/S00_ACLK] [get_bd_pins AXI_Register_Demux/M00_ACLK] \
  [get_bd_pins AXI_Register_Demux/M01_ACLK] [get_bd_pins AXI_Register_Demux/M02_ACLK] \
  [get_bd_pins AXI_Register_Demux/M03_ACLK] [get_bd_pins AXI_Register_Demux/M04_ACLK] \
  [get_bd_pins AXI_Register_Demux/M05_ACLK] [get_bd_pins AXI_Register_Demux/M06_ACLK] \
  [get_bd_pins AXI_Register_Demux/M07_ACLK] [get_bd_pins AXI_Register_Demux/M08_ACLK] [get_bd_pins AXI_Register_Demux/ACLK]
connect_bd_net -net rst_ps7_0_100M_peripheral_aresetn [get_bd_pins M00_ARESETN] \
  [get_bd_pins AXI_Register_Demux/M00_ARESETN] [get_bd_pins AXI_Register_Demux/M01_ARESETN] \
  [get_bd_pins AXI_Register_Demux/M02_ARESETN] [get_bd_pins AXI_Register_Demux/M03_ARESETN] \
  [get_bd_pins AXI_Register_Demux/M04_ARESETN] [get_bd_pins AXI_Register_Demux/M05_ARESETN] \
  [get_bd_pins AXI_Register_Demux/M06_ARESETN] [get_bd_pins AXI_Register_Demux/M07_ARESETN] \
  [get_bd_pins AXI_Register_Demux/M08_ARESETN] [get_bd_pins AXI_Register_Demux/S00_ARESETN]

current_bd_instance /TX_BUFFER
connect_bd_intf_net [get_bd_intf_pins M00_AXIS] [get_bd_intf_pins TxFIFO/M00_AXIS]
connect_bd_intf_net -intf_net axis_switch_1_M01_AXIS [get_bd_intf_pins S00_AXIS] [get_bd_intf_pins TxFIFO/S00_AXIS]
connect_bd_intf_net [get_bd_intf_pins S00_AXI] [get_bd_intf_pins TxFIFO/S00_AXI]
connect_bd_net [get_bd_pins TxFIFO/bram0_even_addr_a] [get_bd_pins blk0_mem_tx_even/addra]
connect_bd_net [get_bd_pins TxFIFO/bram0_even_addr_b] [get_bd_pins blk0_mem_tx_even/addrb]
connect_bd_net [get_bd_pins TxFIFO/bram0_even_data_a] [get_bd_pins blk0_mem_tx_even/dina]
connect_bd_net [get_bd_pins TxFIFO/bram0_even_en_a] [get_bd_pins blk0_mem_tx_even/ena]
connect_bd_net [get_bd_pins TxFIFO/bram0_even_en_b] [get_bd_pins blk0_mem_tx_even/enb]
connect_bd_net [get_bd_pins TxFIFO/bram0_even_we_a] [get_bd_pins blk0_mem_tx_even/wea]
connect_bd_net [get_bd_pins TxFIFO/bram0_odd_addr_a] [get_bd_pins blk0_mem_tx_odd/addra]
connect_bd_net [get_bd_pins TxFIFO/bram0_odd_addr_b] [get_bd_pins blk0_mem_tx_odd/addrb]
connect_bd_net [get_bd_pins TxFIFO/bram0_odd_data_a] [get_bd_pins blk0_mem_tx_odd/dina]
connect_bd_net [get_bd_pins TxFIFO/bram0_odd_en_a] [get_bd_pins blk0_mem_tx_odd/ena]
connect_bd_net [get_bd_pins TxFIFO/bram0_odd_en_b] [get_bd_pins blk0_mem_tx_odd/enb]
connect_bd_net [get_bd_pins TxFIFO/bram0_odd_we_a] [get_bd_pins blk0_mem_tx_odd/wea]
connect_bd_net [get_bd_pins TxFIFO/bram1_even_addr_a] [get_bd_pins blk1_mem_tx_even/addra]
connect_bd_net [get_bd_pins TxFIFO/bram1_even_addr_b] [get_bd_pins blk1_mem_tx_even/addrb]
connect_bd_net [get_bd_pins TxFIFO/bram1_even_data_a] [get_bd_pins blk1_mem_tx_even/dina]
connect_bd_net [get_bd_pins TxFIFO/bram1_even_en_a] [get_bd_pins blk1_mem_tx_even/ena]
connect_bd_net [get_bd_pins TxFIFO/bram1_even_en_b] [get_bd_pins blk1_mem_tx_even/enb]
connect_bd_net [get_bd_pins TxFIFO/bram1_even_we_a] [get_bd_pins blk1_mem_tx_even/wea]
connect_bd_net [get_bd_pins TxFIFO/bram1_odd_addr_a] [get_bd_pins blk1_mem_tx_odd/addra]
connect_bd_net [get_bd_pins TxFIFO/bram1_odd_addr_b] [get_bd_pins blk1_mem_tx_odd/addrb]
connect_bd_net [get_bd_pins TxFIFO/bram1_odd_data_a] [get_bd_pins blk1_mem_tx_odd/dina]
connect_bd_net [get_bd_pins TxFIFO/bram1_odd_en_a] [get_bd_pins blk1_mem_tx_odd/ena]
connect_bd_net [get_bd_pins TxFIFO/bram1_odd_en_b] [get_bd_pins blk1_mem_tx_odd/enb]
connect_bd_net [get_bd_pins TxFIFO/bram1_odd_we_a] [get_bd_pins blk1_mem_tx_odd/wea]
connect_bd_net [get_bd_pins TxFIFO/bram2_even_addr_a] [get_bd_pins blk2_mem_tx_even/addra]
connect_bd_net [get_bd_pins TxFIFO/bram2_even_addr_b] [get_bd_pins blk2_mem_tx_even/addrb]
connect_bd_net [get_bd_pins TxFIFO/bram2_even_data_a] [get_bd_pins blk2_mem_tx_even/dina]
connect_bd_net [get_bd_pins TxFIFO/bram2_even_en_a] [get_bd_pins blk2_mem_tx_even/ena]
connect_bd_net [get_bd_pins TxFIFO/bram2_even_en_b] [get_bd_pins blk2_mem_tx_even/enb]
connect_bd_net [get_bd_pins TxFIFO/bram2_even_we_a] [get_bd_pins blk2_mem_tx_even/wea]
connect_bd_net [get_bd_pins TxFIFO/bram2_odd_addr_a] [get_bd_pins blk2_mem_tx_odd/addra]
connect_bd_net [get_bd_pins TxFIFO/bram2_odd_addr_b] [get_bd_pins blk2_mem_tx_odd/addrb]
connect_bd_net [get_bd_pins TxFIFO/bram2_odd_data_a] [get_bd_pins blk2_mem_tx_odd/dina]
connect_bd_net [get_bd_pins TxFIFO/bram2_odd_en_a] [get_bd_pins blk2_mem_tx_odd/ena]
connect_bd_net [get_bd_pins TxFIFO/bram2_odd_en_b] [get_bd_pins blk2_mem_tx_odd/enb]
connect_bd_net [get_bd_pins TxFIFO/bram2_odd_we_a] [get_bd_pins blk2_mem_tx_odd/wea]
connect_bd_net [get_bd_pins TxFIFO/irq_full] [get_bd_pins irq_full]
connect_bd_net [get_bd_pins TxFIFO/txfifo_full] [get_bd_pins LED0]
connect_bd_net [get_bd_pins blk0_mem_tx_even/doutb] [get_bd_pins TxFIFO/bram0_even_rdata_b]
connect_bd_net [get_bd_pins blk0_mem_tx_odd/doutb] [get_bd_pins TxFIFO/bram0_odd_rdata_b]
connect_bd_net [get_bd_pins blk1_mem_tx_even/doutb] [get_bd_pins TxFIFO/bram1_even_rdata_b]
connect_bd_net [get_bd_pins blk1_mem_tx_odd/doutb] [get_bd_pins TxFIFO/bram1_odd_rdata_b]
connect_bd_net [get_bd_pins blk2_mem_tx_even/doutb] [get_bd_pins TxFIFO/bram2_even_rdata_b]
connect_bd_net [get_bd_pins blk2_mem_tx_odd/doutb] [get_bd_pins TxFIFO/bram2_odd_rdata_b]
connect_bd_net -net processing_system7_0_FCLK_CLK0 [get_bd_pins clk] \
  [get_bd_pins blk2_mem_tx_odd/clka] [get_bd_pins blk2_mem_tx_odd/clkb] [get_bd_pins blk2_mem_tx_even/clkb] \
  [get_bd_pins blk2_mem_tx_even/clka] [get_bd_pins blk1_mem_tx_odd/clkb] [get_bd_pins blk1_mem_tx_even/clkb] \
  [get_bd_pins blk1_mem_tx_even/clka] [get_bd_pins blk0_mem_tx_odd/clkb] [get_bd_pins blk0_mem_tx_odd/clka] \
  [get_bd_pins blk0_mem_tx_even/clkb] [get_bd_pins blk0_mem_tx_even/clka] [get_bd_pins blk1_mem_tx_odd/clka] \
  [get_bd_pins TxFIFO/clk]
connect_bd_net -net rst_ps7_0_100M_peripheral_aresetn [get_bd_pins rstn] [get_bd_pins TxFIFO/rstn]

current_bd_instance /
connect_bd_intf_net -intf_net AXI_Register_Demux_M00_AXI [get_bd_intf_pins LOOP1/S_AXI_CTRL] [get_bd_intf_pins REGISTER_DEMUX/M00_AXI]
connect_bd_intf_net -intf_net AXI_Register_Demux_M06_AXI [get_bd_intf_pins LOOP1/S_AXI_CTRL1] [get_bd_intf_pins REGISTER_DEMUX/M06_AXI]
connect_bd_intf_net -intf_net AXI_Register_Demux_M07_AXI [get_bd_intf_pins REGISTER_DEMUX/M07_AXI] [get_bd_intf_pins LOOP2/S_AXI_CTRL]
connect_bd_intf_net -intf_net AXI_Register_Demux_M08_AXI [get_bd_intf_pins REGISTER_DEMUX/M08_AXI] [get_bd_intf_pins LOOP2/S_AXI_CTRL1]
connect_bd_intf_net [get_bd_intf_pins BiDirChannels_0/M00_AXIS] [get_bd_intf_pins LOOP2/S00_AXIS1]
connect_bd_intf_net -intf_net RxFIFO_M00_AXIS [get_bd_intf_pins RX_BUFFER/M00_AXIS] [get_bd_intf_pins LOOP1/S01_AXIS]
connect_bd_intf_net -intf_net TxFIFO_M00_AXIS [get_bd_intf_pins TX_BUFFER/M00_AXIS] [get_bd_intf_pins LOOP2/S00_AXIS]
connect_bd_intf_net -intf_net axi_dma_0_M_AXIS_MM2S [get_bd_intf_pins LOOP1/S00_AXIS] [get_bd_intf_pins DMA/M_AXIS_MM2S]
connect_bd_intf_net -intf_net axis_switch_0_M00_AXIS [get_bd_intf_pins LOOP1/M00_AXIS] [get_bd_intf_pins DMA/S_AXIS_S2MM]
connect_bd_intf_net -intf_net axis_switch_1_M01_AXIS [get_bd_intf_pins TX_BUFFER/S00_AXIS] [get_bd_intf_pins LOOP1/M01_AXIS]
connect_bd_intf_net -intf_net axis_switch_2_M00_AXIS [get_bd_intf_pins LOOP2/M00_AXIS] [get_bd_intf_pins BiDirChannels_0/S00_AXIS]
connect_bd_intf_net -intf_net axis_switch_3_M00_AXIS [get_bd_intf_pins LOOP2/M00_AXIS1] [get_bd_intf_pins RX_BUFFER/S00_AXIS]
connect_bd_intf_net [get_bd_intf_ports DDR] [get_bd_intf_pins processing_system7_0/DDR]
connect_bd_intf_net [get_bd_intf_ports FIXED_IO] [get_bd_intf_pins processing_system7_0/FIXED_IO]
connect_bd_intf_net [get_bd_intf_pins processing_system7_0/M_AXI_GP0] [get_bd_intf_pins REGISTER_DEMUX/S00_AXI]
connect_bd_intf_net [get_bd_intf_pins REGISTER_DEMUX/M01_AXI] [get_bd_intf_pins SPI/S00_AXI]
connect_bd_intf_net [get_bd_intf_pins REGISTER_DEMUX/M02_AXI] [get_bd_intf_pins BiDirChannels_0/S00_AXI]
connect_bd_intf_net [get_bd_intf_pins REGISTER_DEMUX/M03_AXI] [get_bd_intf_pins DMA/S_AXI_LITE]
connect_bd_intf_net [get_bd_intf_pins REGISTER_DEMUX/M04_AXI] [get_bd_intf_pins RX_BUFFER/S00_AXI]
connect_bd_intf_net [get_bd_intf_pins TX_BUFFER/S00_AXI] [get_bd_intf_pins REGISTER_DEMUX/M05_AXI]
connect_bd_intf_net -intf_net smartconnect_0_M00_AXI [get_bd_intf_pins processing_system7_0/S_AXI_HP0] [get_bd_intf_pins DMA/M00_AXI]
connect_bd_net -net BiDirChannels_0_HSI_DAM [get_bd_pins BiDirChannels_0/DTX] [get_bd_ports DTX]
connect_bd_net -net BiDirChannels_0_HSI_DAP [get_bd_pins BiDirChannels_0/DSYNC] [get_bd_ports DSYNC]
connect_bd_net [get_bd_pins BiDirChannels_0/MCK_N] [get_bd_ports MCK_N]
connect_bd_net [get_bd_pins BiDirChannels_0/MCK_P] [get_bd_ports MCK_P]
connect_bd_net [get_bd_pins BiDirChannels_0/SYNCK] [get_bd_ports SYNC_CK]
connect_bd_net [get_bd_pins BiDirChannels_0/txclk] [get_bd_pins RESETS/slowest_sync_clk] [get_bd_pins led_driver_0/clk]
connect_bd_net [get_bd_pins DMA/mm2s_introut] [get_bd_pins xlconcat_1/In0]
connect_bd_net [get_bd_pins DMA/s2mm_introut] [get_bd_pins xlconcat_1/In1]
connect_bd_net -net HSI_A0_1 [get_bd_ports DRX] [get_bd_pins BiDirChannels_0/DRX]
connect_bd_net [get_bd_ports SPI_DN] [get_bd_pins SPI/SPI_DN]
connect_bd_net [get_bd_pins RX_BUFFER/irq_full] [get_bd_pins xlconcat_1/In2]
connect_bd_net -net RxFIFO_rxfifo_full [get_bd_pins RX_BUFFER/LED1] [get_bd_ports LED1]
connect_bd_net -net SPI_ip_0_SPI_CS [get_bd_pins SPI/SPI_CSN] [get_bd_ports SPI_CSN]
connect_bd_net -net SPI_ip_0_SPI_SCK [get_bd_pins SPI/SPI_SCK] [get_bd_ports SPI_SCK]
connect_bd_net [get_bd_pins TX_BUFFER/irq_full] [get_bd_pins xlconcat_1/In3]
connect_bd_net -net TxFIFO_txfifo_full [get_bd_pins TX_BUFFER/LED0] [get_bd_ports LED0]
connect_bd_net [get_bd_pins led_driver_0/led0] [get_bd_ports LED2]
connect_bd_net [get_bd_pins led_driver_0/led1] [get_bd_ports LED3]
connect_bd_net [get_bd_pins led_driver_0/led2] [get_bd_ports LED4]
connect_bd_net [get_bd_pins led_driver_0/led3] [get_bd_ports LED5]
connect_bd_net [get_bd_pins led_driver_0/led4] [get_bd_ports LED6]
connect_bd_net [get_bd_pins led_driver_0/led5] [get_bd_ports LED7]
connect_bd_net -net proc_sys_reset_0_interconnect_aresetn [get_bd_pins RESETS/interconnect_aresetn] [get_bd_pins REGISTER_DEMUX/ARESETN]
connect_bd_net [get_bd_pins processing_system7_0/FCLK_CLK0] \
  [get_bd_pins processing_system7_0/M_AXI_GP0_ACLK] [get_bd_pins processing_system7_0/S_AXI_HP0_ACLK] \
  [get_bd_pins RX_BUFFER/clk] [get_bd_pins LOOP1/s_axi_ctrl_aclk] [get_bd_pins LOOP2/s_axi_ctrl_aclk] \
  [get_bd_pins RESETS/slowest_sync_clk1] [get_bd_pins SPI/clk] [get_bd_pins DMA/s_axi_lite_aclk] \
  [get_bd_pins REGISTER_DEMUX/S00_ACLK] [get_bd_pins TX_BUFFER/clk] [get_bd_pins BiDirChannels_0/clk]
connect_bd_net [get_bd_pins processing_system7_0/FCLK_RESET0_N] [get_bd_pins RESETS/ext_reset_in]
connect_bd_net -net rst_ps7_0_100M_peripheral_aresetn [get_bd_pins RESETS/peripheral_aresetn1] \
  [get_bd_pins RX_BUFFER/rst_n] [get_bd_pins LOOP1/s_axi_ctrl_aresetn] [get_bd_pins LOOP2/s_axi_ctrl_aresetn] \
  [get_bd_pins SPI/rstn] [get_bd_pins DMA/axi_resetn] [get_bd_pins REGISTER_DEMUX/M00_ARESETN] [get_bd_pins TX_BUFFER/rstn] \
  [get_bd_pins BiDirChannels_0/rst_n]
connect_bd_net -net txclk_reset_domain_peripheral_aresetn [get_bd_pins RESETS/peripheral_aresetn] \
  [get_bd_pins led_driver_0/rstn] [get_bd_pins BiDirChannels_0/tx_rstn]
connect_bd_net [get_bd_pins xlconcat_1/dout] [get_bd_pins processing_system7_0/IRQ_F2P]

# ---- address map ----
assign_bd_address -offset 0x00000000 -range 512M -target_address_space [get_bd_addr_spaces DMA/axi_dma_0/Data_MM2S] [get_bd_addr_segs processing_system7_0/S_AXI_HP0/HP0_DDR_LOWOCM]
assign_bd_address -offset 0x00000000 -range 512M -target_address_space [get_bd_addr_spaces DMA/axi_dma_0/Data_S2MM] [get_bd_addr_segs processing_system7_0/S_AXI_HP0/HP0_DDR_LOWOCM]
assign_bd_address -offset 0x40400000 -range 64K -target_address_space [get_bd_addr_spaces processing_system7_0/Data] [get_bd_addr_segs DMA/axi_dma_0/S_AXI_LITE/Reg]
assign_bd_address -offset 0x43C00000 -range 64K -target_address_space [get_bd_addr_spaces processing_system7_0/Data] [get_bd_addr_segs LOOP1/axis_switch_0/S_AXI_CTRL/Reg]
assign_bd_address -offset 0x43C10000 -range 64K -target_address_space [get_bd_addr_spaces processing_system7_0/Data] [get_bd_addr_segs SPI/SPI_ip_0/S00_AXI/S00_AXI_reg]
assign_bd_address -offset 0x43C20000 -range 64K -target_address_space [get_bd_addr_spaces processing_system7_0/Data] [get_bd_addr_segs BiDirChannels_0/S00_AXI/S00_AXI_reg]
assign_bd_address -offset 0x43C30000 -range 64K -target_address_space [get_bd_addr_spaces processing_system7_0/Data] [get_bd_addr_segs RX_BUFFER/RxFIFO/S00_AXI/S00_AXI_reg]
assign_bd_address -offset 0x43C40000 -range 64K -target_address_space [get_bd_addr_spaces processing_system7_0/Data] [get_bd_addr_segs TX_BUFFER/TxFIFO/S00_AXI/S00_AXI_reg]
assign_bd_address -offset 0x43C50000 -range 64K -target_address_space [get_bd_addr_spaces processing_system7_0/Data] [get_bd_addr_segs LOOP1/axis_switch_1/S_AXI_CTRL/Reg]
assign_bd_address -offset 0x43C60000 -range 64K -target_address_space [get_bd_addr_spaces processing_system7_0/Data] [get_bd_addr_segs LOOP2/axis_switch_2/S_AXI_CTRL/Reg]
assign_bd_address -offset 0x43C70000 -range 64K -target_address_space [get_bd_addr_spaces processing_system7_0/Data] [get_bd_addr_segs LOOP2/axis_switch_3/S_AXI_CTRL/Reg]

validate_bd_design
save_bd_design
